# Altium schematic sheet LCD_Glass.SchDoc: LCD_Glass
size A3; DocumentNumber: MB1144; Revision: C-02; SheetNumber: 5; SheetTotal: 25; PageSetup: Record=PageOptions|CenterHorizontal=True|CenterVertical=True|PrintScale=1.04|XCorrection=1.00|YCorrection=1.00|PrintKind=1|BorderSize=5000000|LeftOffset=0|BottomOffset=0|Orientation=2|PaperLength=1000|PaperWidth=1000|Scale=100|PaperSource=7|PrintQuality=600|MediaType=1|DitherType=10|PaperKind=A3|PrintScaleMode=1; Project: STM32L476G-EVAL; ModifiedDate: 9/23/2015
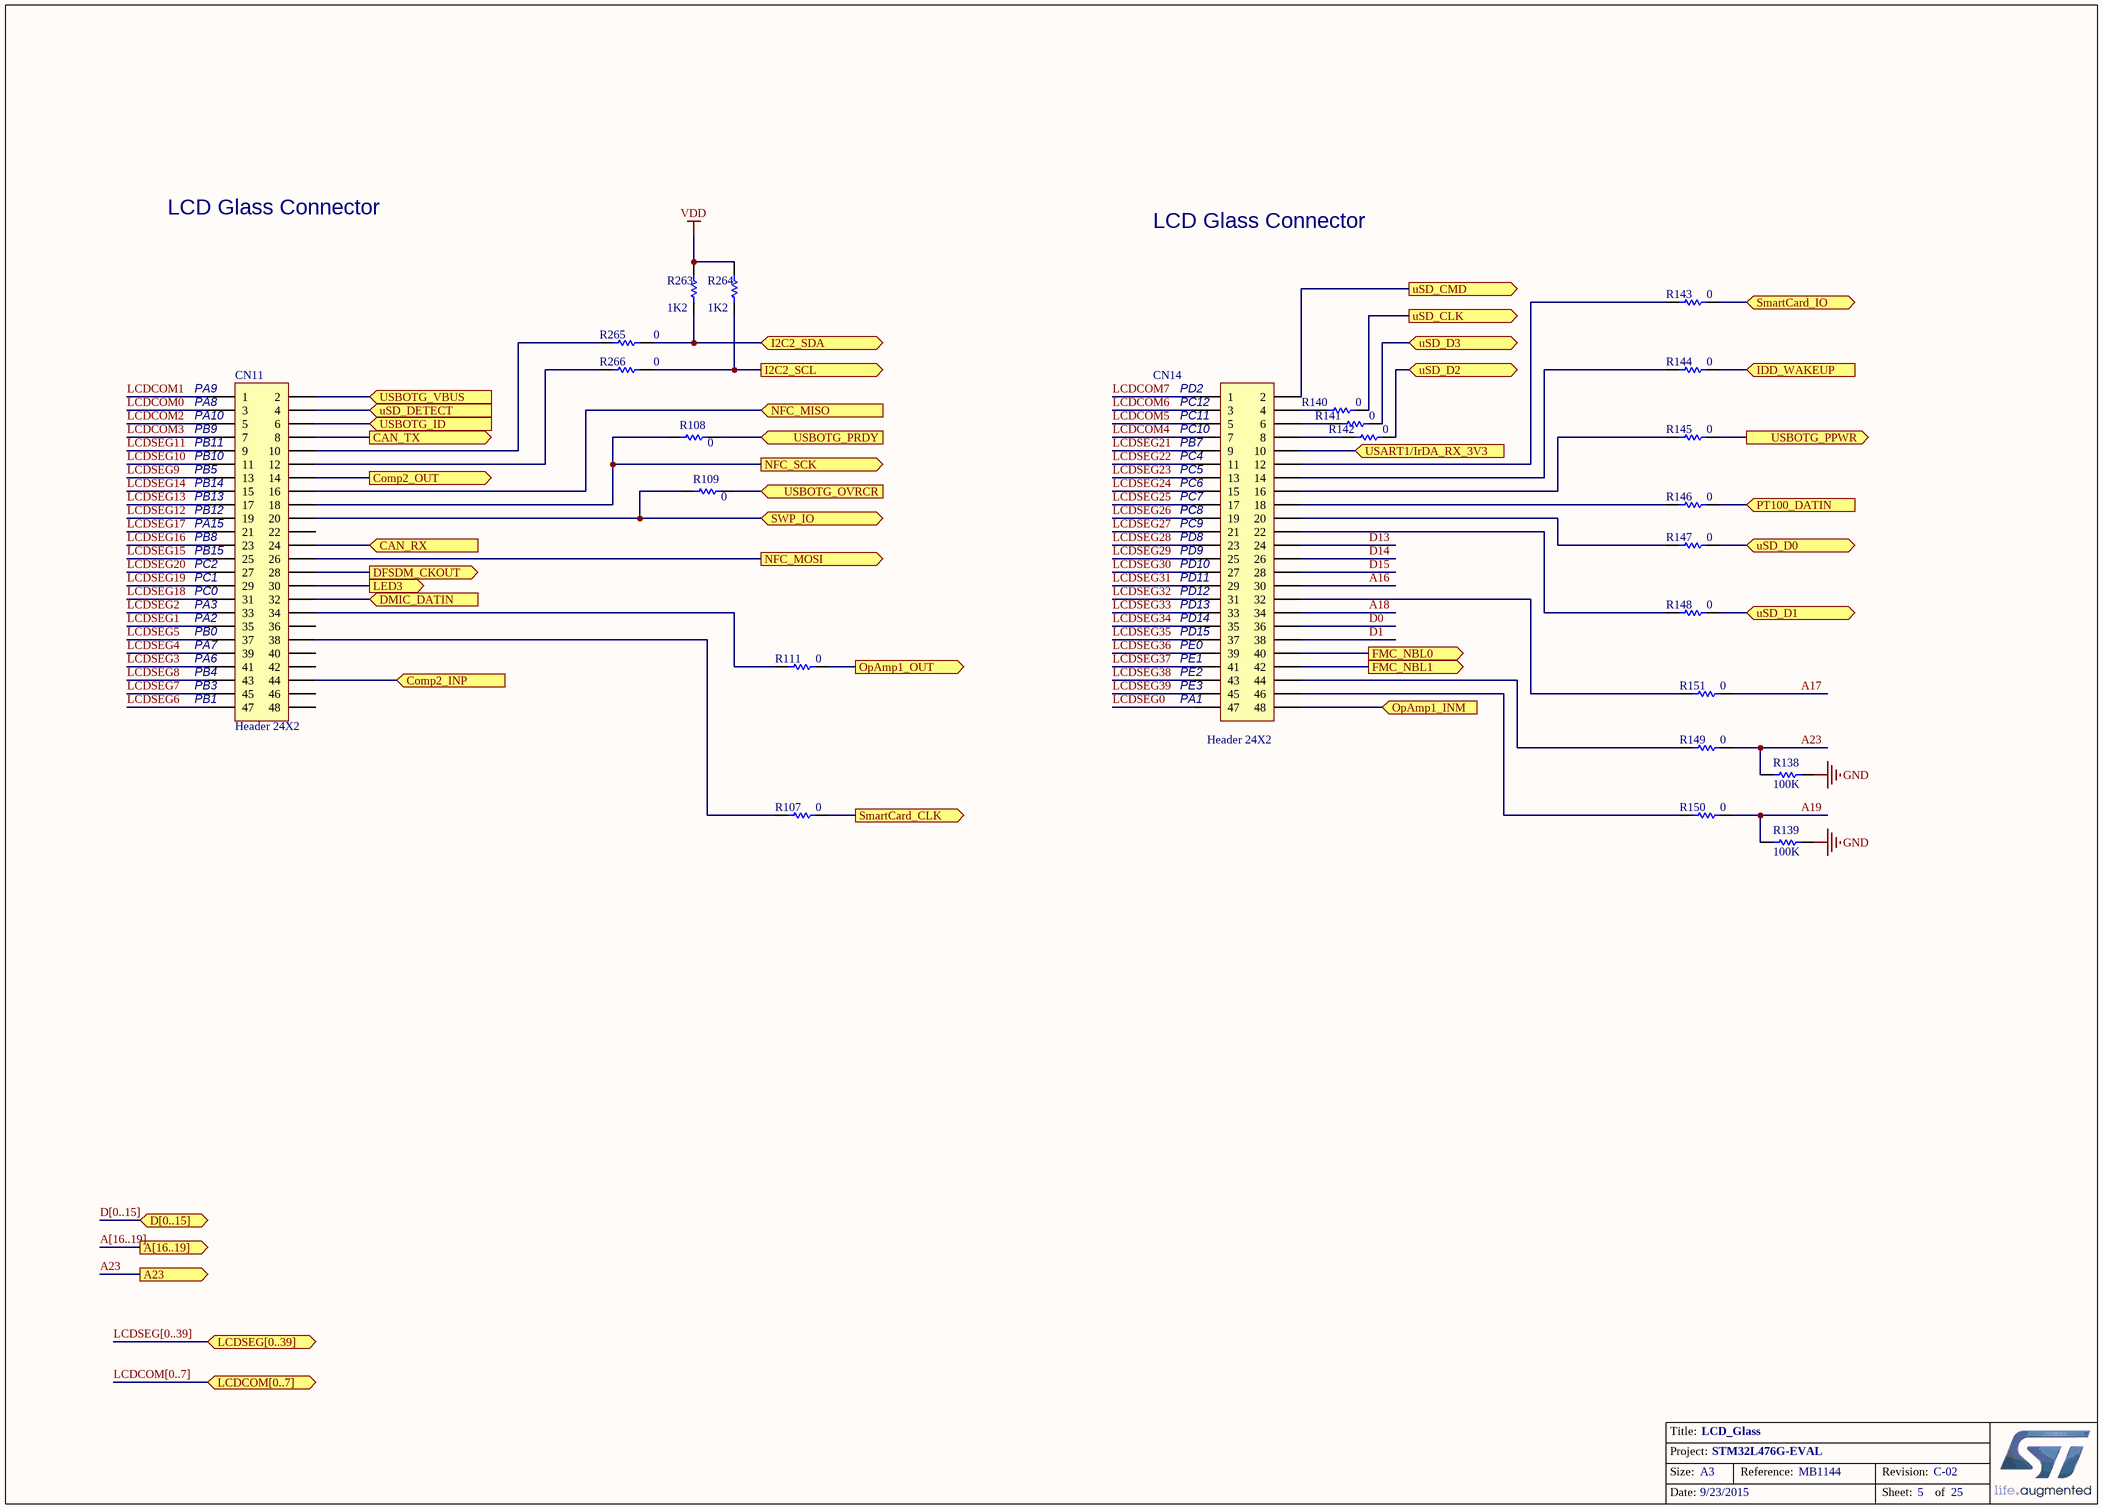
[diagram p0: LCD_Glass.SchDoc]

## Parts
CN11  Header 24X2  [HDR_2X24_2R54]
CN14  Header 24X2  [HDR_2X24_2R54]
R107  0  [0603R]
R108  0  [SB_0603]
R109  0  [SB_0603]
R111  0  [0603R]
R138  100K  [0402R]
R139  100K  [0402R]
R140  0  [0603R]
R141  0  [0603R]
R142  0  [0603R]
R143  0  [0603R]
R144  0  [0603R]
R145  0  [0603R]
R146  0  [0603R]
R147  0  [0603R]
R148  0  [0603R]
R149  0  [0603R]
R150  0  [0603R]
R151  0  [0603R]
R263  1K2  [0402R]
R264  1K2  [0402R]
R265  0  [0603R]
R266  0  [0603R]

## Ports
A23 (out), A[16..19] (out), CAN_RX (in), CAN_TX (out), Comp2_INP (in), Comp2_OUT (out), D[0..15] (bidir), DFSDM_CKOUT (out), DMIC_DATIN (in), FMC_NBL0 (out), FMC_NBL1 (out), I2C2_SCL (out), I2C2_SDA (bidir), IDD_WAKEUP (in), LCDCOM[0..7] (bidir), LCDSEG[0..39] (bidir), LED3 (out), NFC_MISO (in), NFC_MOSI (out), NFC_SCK (out), OpAmp1_INM (in), OpAmp1_OUT (out), PT100_DATIN (in), SmartCard_CLK (out), SmartCard_IO (bidir), SWP_IO (bidir), USART1/IrDA_RX_3V3 (in), USBOTG_ID (in), USBOTG_OVRCR (in), USBOTG_PPWR (out), USBOTG_PRDY (in), USBOTG_VBUS (in), uSD_CLK (out), uSD_CMD (out), uSD_D0 (bidir), uSD_D1 (bidir), uSD_D2 (bidir), uSD_D3 (bidir), uSD_DETECT (in)

## Nets
GND: R138.2 R139.2
VDD: R263.1 R264.1
A16: CN14.30
A17: R151.1
A18: CN14.34
A19: R139.1 R150.1
A23: R138.1 R149.1 ; port A23
CAN_RX: CN11.24 ; port CAN_RX
CAN_TX: CN11.8 ; port CAN_TX
Comp2_INP: CN11.44 ; port Comp2_INP
Comp2_OUT: CN11.14 ; port Comp2_OUT
D0: CN14.36
D1: CN14.38
D13: CN14.24
D14: CN14.26
D15: CN14.28
DFSDM_CKOUT: CN11.28 ; port DFSDM_CKOUT
DMIC_DATIN: CN11.32 ; port DMIC_DATIN
FMC_NBL0: CN14.40 ; port FMC_NBL0
FMC_NBL1: CN14.42 ; port FMC_NBL1
I2C2_SCL: R264.2 R266.1 ; port I2C2_SCL
I2C2_SDA: R263.2 R265.1 ; port I2C2_SDA
IDD_WAKEUP: R144.1 ; port IDD_WAKEUP
LCDCOM0: CN11.3
LCDCOM1: CN11.1
LCDCOM2: CN11.5
LCDCOM3: CN11.7
LCDCOM4: CN14.7
LCDCOM5: CN14.5
LCDCOM6: CN14.3
LCDCOM7: CN14.1
LCDSEG0: CN14.47
LCDSEG1: CN11.35
LCDSEG2: CN11.33
LCDSEG3: CN11.41
LCDSEG4: CN11.39
LCDSEG5: CN11.37
LCDSEG6: CN11.47
LCDSEG7: CN11.45
LCDSEG8: CN11.43
LCDSEG9: CN11.13
LCDSEG10: CN11.11
LCDSEG11: CN11.9
LCDSEG12: CN11.19
LCDSEG13: CN11.17
LCDSEG14: CN11.15
LCDSEG15: CN11.25
LCDSEG16: CN11.23
LCDSEG17: CN11.21
LCDSEG18: CN11.31
LCDSEG19: CN11.29
LCDSEG20: CN11.27
LCDSEG21: CN14.9
LCDSEG22: CN14.11
LCDSEG23: CN14.13
LCDSEG24: CN14.15
LCDSEG25: CN14.17
LCDSEG26: CN14.19
LCDSEG27: CN14.21
LCDSEG28: CN14.23
LCDSEG29: CN14.25
LCDSEG30: CN14.27
LCDSEG31: CN14.29
LCDSEG32: CN14.31
LCDSEG33: CN14.33
LCDSEG34: CN14.35
LCDSEG35: CN14.37
LCDSEG36: CN14.39
LCDSEG37: CN14.41
LCDSEG38: CN14.43
LCDSEG39: CN14.45
LED3: CN11.30 ; port LED3
NFC_MISO: CN11.16 ; port NFC_MISO
NFC_MOSI: CN11.26 ; port NFC_MOSI
NFC_SCK: CN11.18 R108.1 ; port NFC_SCK
OpAmp1_INM: CN14.48 ; port OpAmp1_INM
OpAmp1_OUT: R111.1 ; port OpAmp1_OUT
PT100_DATIN: R146.1 ; port PT100_DATIN
SmartCard_CLK: R107.1 ; port SmartCard_CLK
SmartCard_IO: R143.1 ; port SmartCard_IO
SWP_IO: CN11.20 R109.1 ; port SWP_IO
USART1/IrDA_RX_3V3: CN14.10 ; port USART1/IrDA_RX_3V3
USBOTG_ID: CN11.6 ; port USBOTG_ID
USBOTG_OVRCR: R109.2 ; port USBOTG_OVRCR
USBOTG_PPWR: R145.1 ; port USBOTG_PPWR
USBOTG_PRDY: R108.2 ; port USBOTG_PRDY
USBOTG_VBUS: CN11.2 ; port USBOTG_VBUS
uSD_CLK: R140.1 ; port uSD_CLK
uSD_CMD: CN14.2 ; port uSD_CMD
uSD_D0: R147.1 ; port uSD_D0
uSD_D1: R148.1 ; port uSD_D1
uSD_D2: R142.1 ; port uSD_D2
uSD_D3: R141.1 ; port uSD_D3
uSD_DETECT: CN11.4 ; port uSD_DETECT
NetCN11_10: CN11.10 R265.2
NetCN11_12: CN11.12 R266.2
NetCN11_34: CN11.34 R111.2
NetCN11_38: CN11.38 R107.2
NetCN14_4: CN14.4 R140.2
NetCN14_6: CN14.6 R141.2
NetCN14_8: CN14.8 R142.2
NetCN14_12: CN14.12 R143.2
NetCN14_14: CN14.14 R144.2
NetCN14_16: CN14.16 R145.2
NetCN14_18: CN14.18 R146.2
NetCN14_20: CN14.20 R147.2
NetCN14_22: CN14.22 R148.2
NetCN14_32: CN14.32 R151.2
NetCN14_44: CN14.44 R149.2
NetCN14_46: CN14.46 R150.2

Not connected (* = marked no-connect by the designer): CN11 22 36 40 42 46 48

## Buses and harness runs
bus A[16..19] = port A[16..19]
bus D[0..15] = port D[0..15]
bus LCDCOM[0..7] = port LCDCOM[0..7]
bus LCDSEG[0..39] = port LCDSEG[0..39]

## Notes on the sheet
- LCD Glass Connector
- (near CN11) PA9
- (near CN11) PA8
- (near CN11) PA10
- (near CN11) PB9
- (near CN11) PB11
- (near CN14) PD2
- (near CN14) PC12
- (near CN14) PC11
- (near CN14) PC10
- (near CN14) PB7
- (near CN11) PB10
- (near CN11) PB5
- (near CN11) PB14
- (near CN11) PB13
- (near CN11) PB12
- (near CN14) PC4
- (near CN14) PC5
- (near CN14) PC6
- (near CN14) PC7
- (near CN14) PC
- (near CN14) PC8
- (near CN11) PA15
- (near CN11) PB8
- (near CN11) PB15
- (near CN11) PC2
- (near CN11) PC1
- (near CN14) PD11
- (near CN14) PD10
- (near CN14) PD9
- (near CN14) PD8
- (near CN14) PC9
- (near CN11) PA3
- (near CN11) PA2
- (near CN11) PA7
- (near CN11) PB0
- (near CN11) PC0
- (near CN14) PD12
- (near CN14) PD13
- (near CN14) PD14
- (near CN14) PD15
- (near CN14) PE0
- (near CN11) PA6
- (near CN11) PB4
- (near CN11) PB3
- (near CN11) PB1
- (near CN14) PE1
- (near CN14) PE2
- (near CN14) PE3
- (near CN14) PA1
- Title:
- Project:
- Size:
- Date:
- A3
- Reference:
- Sheet:
- Revision:
- of

## Library data of the parts
CN11 CN14 = Header 24X2: Header, 24-Pin, Dual row; Ordered by: Subcon; Comments: LCD Glass connector; ECCN_US/EU: NA; Assembly: with MB979; Revision: 17-Jul-2002: Re-released for DXP Platform.; Publisher: Altium Limited
R107 R111 R138-R151 = res1: Resistor; Value: 1K; Ordered by: Subcon; ECCN_US/EU: NA; Published: 8-Jun-2000; Revision: July-2002: Re-released for DXP Platform.; Publisher: Altium Limited
R108 R109 R263-R266 = Res1: Resistor; Value: 1K; Ordered by: Subcon; ECCN_US/EU: NA; Published: 8-Jun-2000; Revision: July-2002: Re-released for DXP Platform.; Publisher: Altium Limited